# Altium schematic sheet P2.schdoc
size 297 x 209 mm; Symbol: Drawing-Symbol_A4; Company: 嘉立创EDA; Version: V1.0; Page Size: A4; @Project Name: 40Hz音箱; @Update Date: 2026-01-13; @Create Date: 2026-01-13; Device: Drawing-Symbol_A4; @Board Name: Board1; @Page Name: P2; @Create Time: 14:52:46; @Page Count: 1; @Page No: 0; @Schematic Name: Schematic1; @Update Time: 14:52:46; @Assembly Variant: Basic; Border: 1; Title Block Position: 3; Size: A4; Width: 1170; Height: 825; Region Start: 1; X Region Count: 6; Y Region Count: 4; Blade Width: 10
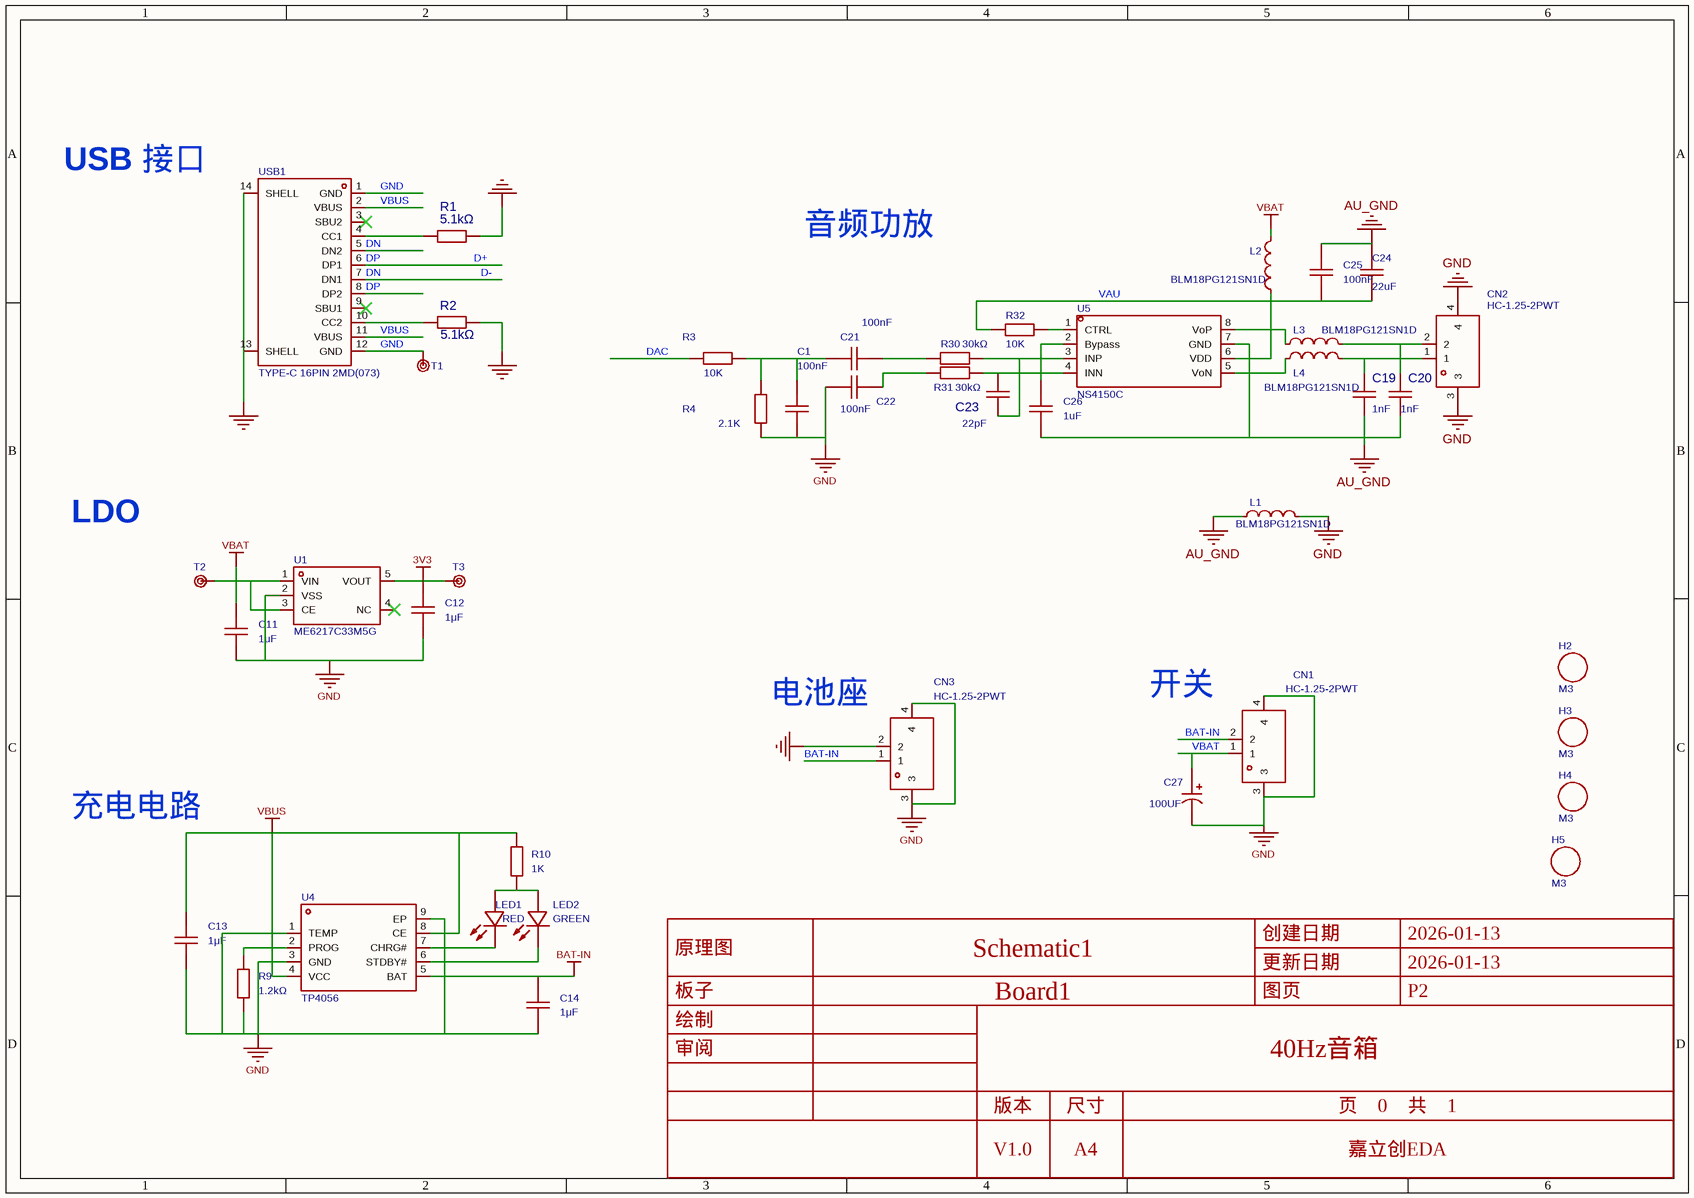
[diagram p0: P2.schdoc]

## Parts
C1  100nF  [C0603]
C11  1μF  [C0603]
C12  1μF  [C0603]
C13  1μF  [C0603]
C14  1μF  [C0603]
C19  1nF  [C0603]
C20  1nF  [C0603]
C21  100nF  [C0603]
C22  100nF  [C0603]
C23  22pF  [C0603]
C24  22uF  [C0603_1]
C25  100nF  [C0603]
C26  1uF  [C0603]
C27  100UF  [CAP-SMD_BD6.3-L6.6-W6.6-FD-1]
CN1  HC-1.25-2PWT  [CONN-SMD_2P-P1.25-HC-1.25-2PWT]
CN2  HC-1.25-2PWT  [CONN-SMD_2P-P1.25-HC-1.25-2PWT]
CN3  HC-1.25-2PWT  [CONN-SMD_2P-P1.25-HC-1.25-2PWT]
H2  M3  [M3 125X200(1)]
H3  M3  [M3 125X200(1)]
H4  M3  [M3 125X200(1)]
H5  M3  [M3 125X200(1)]
L1  BLM18PG121SN1D  [L0603]
L2  BLM18PG121SN1D  [L0603]
L3  BLM18PG121SN1D  [L0603]
L4  BLM18PG121SN1D  [L0603]
LED1  RED  [LED0805-R-RD]
LED2  GREEN  [LED0805-R-RD]
R1  5.1kΩ  [R0402]
R2  5.1kΩ  [R0402]
R3  10K  [R0603]
R4  2.1K  [R0603]
R9  1.2kΩ  [R0603]
R10  1K  [R0603]
R30  30kΩ  [R0603]
R31  30kΩ  [R0603]
R32  10K  [R0603]
T1  GND  [TP-TH-1.5mm]  (value not drawn)
T2  GND  [TP-TH-1.5mm]  (value not drawn)
T3  GND  [TP-TH-1.5mm]  (value not drawn)
U1  ME6217C33M5G  [SOT-23-5_L3.0-W1.7-P0.95-LS2.8-BR]
U4  TP4056  [ESOP-8_L4.9-W3.9-P1.27-LS6.0-BL-EP]
U5  NS4150C  [SOP-8_L4.9-W3.9-P1.27-LS6.0-BL]
USB1  TYPE-C 16PIN 2MD(073)  [USB-C-SMD_TYPE-C-6PIN-2MD-073_EX]

## Nets
3V3: C12.2 T3.1 U1.5(VOUT)
AU_GND: C19.1 C20.1 C24.1 C25.2 C26.1 L1.1 U5.7(GND)
BAT-IN: C14.2 CN1.2 CN3.1 U4.5(BAT)
GND: C1.1 C11.1 C12.1 C13.1 C14.1 C22.1 C27.2 CN1.3 CN1.4 CN2.3 CN2.4 CN3.2 CN3.3 CN3.4 L1.2 R1.1 R2.1 R4.1 R9.2 T1.1 U1.2(VSS) U4.1(TEMP) U4.3(GND) U4.9(EP) USB1.1(GND) USB1.12(GND) USB1.13(SHELL) USB1.14(SHELL)
VBAT: C11.2 C27.1 CN1.1 L2.2 T2.1 U1.1(VIN) U1.3(CE)
VBUS: C13.2 R10.1 U4.4(VCC) U4.8(CE) USB1.2(VBUS) USB1.11(VBUS)
D+: USB1.6(DP1) USB1.8(DP2)  [also labelled DP]
D-: USB1.5(DN2) USB1.7(DN1)  [also labelled DN]
DAC: R3.1
VAU: C24.2 C25.1 L2.1 R32.2 U5.6(VDD)
NetC1_2: C1.2 C21.1 R3.2 R4.2
NetC19_2: C19.2 CN2.1 L4.2
NetC20_2: C20.2 CN2.2 L3.2
NetC21_2: C21.2 R30.2
NetC22_2: C22.2 R31.2
NetC23_1: C23.1 R31.1 U5.4(INN)
NetC23_2: C23.2 R30.1 U5.3(INP)
NetC26_2: C26.2 U5.2(Bypass)
NetL3_1: L3.1 U5.8(VoP)
NetL4_1: L4.1 U5.5(VoN)
NetLED1_1: LED1.1(+) LED2.1(+) R10.2
NetLED1_2: LED1.2(-) U4.7(CHRG#)
NetLED2_2: LED2.2(-) U4.6(STDBY#)
NetR1_2: R1.2 USB1.4(CC1)
NetR2_2: R2.2 USB1.10(CC2)
NetR9_1: R9.1 U4.2(PROG)
NetR32_1: R32.1 U5.1(CTRL)

Not connected (* = marked no-connect by the designer): U1 4(NC)*; USB1 3(SBU2)* 9(SBU1)*

## Notes on the sheet
- USB 接口
- 音频功放
- LDO
- 电池座
- 开关
- 充电电路
- 创建日期
- 2026-01-13
- 原理图
- 板子
- Schematic1
- Board1
- 更新日期
- 图页
- P2
- 绘制
- 审阅
- 40Hz音箱
- 版本
- V1.0
- 尺寸
- A4
- 页    0    共    1
- 嘉立创EDA

## Library data of the parts
C1 C22 C26 = CAP_0603: Symbol: Capacitance; 3D Model: ac125912035d415993ca9572d50418b10819f05c4eef4c71ace90d822a990e87; 3D Model Transform: 62.992,31.496,0,0,0,0,0,0,0; ConvertToPcb: yes; ModelName: C0603_L1.6-W0.8-H0.8; Device: CAP_0603; Supplier Footprint: 0603; AddInBom: yes; FootprintName: C0603
  C1 C22: Value: 100nF
  C26: Value: 1uF
C11-C14 = CL10A105KB8NNNC: Manufacturer: SAMSUNG(三星); Add into BOM: yes; 3D Model: ac125912035d415993ca9572d50418b10819f05c4eef4c71ace90d822a990e87; 3D Model Transform: 62.992,31.496,0,0,0,0,0,0,0; ModelName: C0603_L1.6-W0.8-H0.8; Symbol: CL10A105KB8NNNC; Device: CL10A105KB8NNNC; Convert to PCB: yes; Manufacturer Part: CL10A105KB8NNNC; Supplier: LCSC; Supplier Part: CL10A105KB8NNNC.1; FootprintName: C0603
C19 C20 = 0402B102K500NT: 容值:1nF;精度:±10%;额定电压:50V;材质(温度系数):X7R;; Manufacturer: FH(风华); Symbol: 0402B102K500NT_1; Check: true; 3D Model: 36a51122f27c49738f86b3bfa98863e0; 3D Model Transform: 39.37,19.685,0,0,0,0,0,0,0; Tolerance: ±10%; Voltage Rated: 50V; Temperature Coefficient: X7R; AddInBom: yes; ModelName: C0402_L1.0-W0.5-H0.5; Device: 0402B102K500NT; LCSC Part Name: 1nF ±10% 50V; Supplier Footprint: 0402; Datasheet: https://atta.szlcsc.com/upload/public/pdf/source/20200305/C486355_26A10D38EF8C2A5C37091D0039909270.pdf; Value: 1nF; Supplier: LCSC; Manufacturer Part: 0402B102K500NT; Capacitance: 1nF; Supplier Part: C1523; ConvertToPcb: yes; FootprintName: C0603
C21 C25 = CGA0603X7R104K500JT: 容值:100nF;精度:±10%;额定电压:50V;温度系数:X7R;; Manufacturer: HRE(芯声); Add into BOM: yes; 3D Model: ac125912035d415993ca9572d50418b1; 3D Model Transform: 62.992,31.496,0,0,0,0,0,0,0; Tolerance: ±10%; Temperature Coefficient: X7R; Voltage Rating: 50V; ModelName: C0603_L1.6-W0.8-H0.8; Symbol: CGA0603X7R104K500JT; Device: CGA0603X7R104K500JT; Convert to PCB: yes; Supplier: LCSC; Manufacturer Part: CGA0603X7R104K500JT; Value: 100nF; Supplier Part: C6119867; JLCPCB Part Class: Extended Part; LCSC Part Name: 100nF ±10% 50V; Supplier Footprint: 0603; Datasheet: https://item.szlcsc.com/datasheet/CGA0603X7R104K500JT/7062573.html; FootprintName: C0603
C23 = 0402CG220J500NT: 容值:22pF;精度:±5%;额定电压:50V;材质(温度系数):C0G;; Manufacturer: FH(风华); Check: true; 3D Model: 36a51122f27c49738f86b3bfa98863e0; 3D Model Transform: 39.37,19.685,0,0,0,0,0,0,0; Tolerance: ±5%; Voltage Rated: 50V; Temperature Coefficient: C0G; AddInBom: yes; ModelName: C0402_L1.0-W0.5-H0.5; Symbol: 0402CG220J500NT; Device: 0402CG220J500NT; LCSC Part Name: 22pF ±5% 50V; Supplier Footprint: 0402; Datasheet: https://atta.szlcsc.com/upload/public/pdf/source/20200305/C486355_26A10D38EF8C2A5C37091D0039909270.pdf; Value: 22pF; Supplier: LCSC; Manufacturer Part: 0402CG220J500NT; Capacitance: 22pF; Supplier Part: C1555; ConvertToPcb: yes; FootprintName: C0603
C24 = CL10A226MO7JZNC: 容值:22uF;精度:±20%;额定电压:16V;材质(温度系数):X5R;; Manufacturer: SAMSUNG(三星); Check: true; 3D Model: ac125912035d415993ca9572d50418b1; 3D Model Transform: 62.992,31.496,0,0,0,0,0,0,0; Tolerance: ±20%; Voltage Rated: 16V; Temperature Coefficient: X5R; AddInBom: yes; ModelName: C0603_L1.6-W0.8-H0.8; Symbol: CL10A226MO7JZNC; Device: CL10A226MO7JZNC; LCSC Part Name: 22uF ±20% 16V; Supplier Part: C2762594; Manufacturer Part: CL10A226MO7JZNC; Supplier Footprint: 0603; Datasheet: https://atta.szlcsc.com/upload/public/pdf/source/20220811/0832C3B1C642040B023B7A6186895861.pdf; Supplier: LCSC; Value: 22uF; ConvertToPcb: yes; FootprintName: C0603_1
C27 = JVJ25V100M6x5: 容值:100uF;精度:±20%;额定电压:25V;纹波电流:72mA@120Hz;; Manufacturer: JIERR(捷而瑞); AddInBom: yes; ModelId: 041333f082e2432d92aae8a67d2335740819f05c4eef4c71ace90d822a990e87; ModelTransform: 299.212,259.842,0,0,0,0,0,0,0; Tolerance: ±20%; Voltage Rating: 25V; Lifetime: 2000hrs@105℃; Symbol: JVJ25V100M6X5; Device: JVJ25V100M6x5; LCSC Part Name: 100uF ±20% 25V; SupplierPart: C46550402; ManufacturerPart: JVJ25V100M6x5; Supplier Footprint: SMD,D6.3xL5.4mm; JLCPCB Part Class: Extended Part; Datasheet: https://item.szlcsc.com/datasheet/JVJ25V100M6x5/48680096.html; Supplier: LCSC; ConvertToPcb: yes; FootprintName: CAP-SMD_BD6.3-L6.6-W6.6-FD-1; ModelName: CAP-SMD_BD6.3-L6.6-W6.6-FD-1; Value: 100uF; Ripple Current: 72mA@120Hz; Diameter: 6.3mm; Height - Seated (Max): 5.4mm; Operating Temperature: -55℃~+105℃
CN1 = HC-1.25-2PWT: 插针结构:1x2P;间距:1.25mm;安装方式:卧贴;参考系列:PicoBlade(MX 1.25);总PIN数:2P;排数:1;每排PIN数:2;行距:-;额定电流:1A;触头材质:黄铜;触头镀层:锡;工作温度范围:-40℃~+105℃;; Manufacturer: HCTL(华灿天禄); Add into BOM: yes; Pitch: 1.25mm; Pins Structure: 1x2P; Number of PINs Per Row: 2; Current Rating (Max): 1A; 3D Model: ebb1673ebb69408eb1694436aeec70a1; 3D Model Transform: 295.275,206.693,0,0,0,0,0,-39.372,0; Rated Voltage (Max): 125V; Plastic Material: LCP; Flame Retardant Rating: UL94V-0; Supplementary Features: 辅助焊脚; Z-Height of the Board: 3.57mm; X-Length of Bottom Edge on Board (Spacing Line): 7.55mm; Y-Width of Bottom Edge on Board: 5.25mm; Symbol: HC-1.25-2PWT; Device: HC-1.25-2PWT; Convert to PCB: yes; LCSC Part Name: 1x2P 间距:1.25mm 卧贴 系列:PicoBlade(MX 1.25); Supplier Part: C2845379; Manufacturer Part: HC-1.25-2PWT; Supplier Footprint: SMD,P=1.25mm,卧贴; JLCPCB Part Class: Extended Part; Datasheet: https://atta.szlcsc.com/upload/public/pdf/source/20240930/9508A8292CCC87B0C29E3A028D56E30A.pdf; Supplier: LCSC; Reference Series: PicoBlade(MX 1.25); Number of Rows: 1; Row Spacing: -; Mounting Style: 卧贴; Contact Material: 黄铜; Contact Plating: 锡; Operating Temperature Range: -40℃~+105℃; Number of Pins: 2P; Colour: -; FootprintName: CONN-SMD_2P-P1.25-HC-1.25-2PWT; ModelName: CONN-SMD_2P-P1.25-HC-1.25-2PWT
CN2 CN3 = HC-1.25-2PWT: 插针结构:1x2P;间距:1.25mm;安装方式:卧贴;参考系列:PicoBlade(MX 1.25);总PIN数:2P;排数:1;每排PIN数:2;行距:-;额定电流:1A;触头材质:黄铜;触头镀层:锡;工作温度范围:-40℃~+105℃;; Manufacturer: HCTL(华灿天禄); 3D Model: ebb1673ebb69408eb1694436aeec70a10819f05c4eef4c71ace90d822a990e87; 3D Model Transform: 295.275,206.693,0,0,0,0,0,-39.372,0; Pins Structure: 1x2P; Pitch: 1.25mm; Number of PINs Per Row: 2; Current Rating (Max): 1A; Rated Voltage (Max): 125V; Plastic Material: LCP; Flame Retardant Rating: UL94V-0; Supplementary Features: 辅助焊脚; Z-Height of the Board: 3.57mm; X-Length of Bottom Edge on Board (Spacing Line): 7.55mm; Y-Width of Bottom Edge on Board: 5.25mm; AddInBom: yes; Symbol: HC-1.25-2PWT; Device: HC-1.25-2PWT; LCSC Part Name: 1x2P 间距:1.25mm 卧贴 系列:PicoBlade(MX 1.25); Supplier Part: C2845379; Manufacturer Part: HC-1.25-2PWT; Supplier Footprint: SMD,P=1.25mm,卧贴; JLCPCB Part Class: Extended Part; Datasheet: https://atta.szlcsc.com/upload/public/pdf/source/20240930/9508A8292CCC87B0C29E3A028D56E30A.pdf; Supplier: LCSC; Mounting Style: 卧贴; Reference Series: PicoBlade(MX 1.25); Number of Pins: 2P; Number of Rows: 1; Row Spacing: -; Contact Material: 黄铜; Contact Plating: 锡; Operating Temperature Range: -40℃~+105℃; Colour: -; ConvertToPcb: yes; FootprintName: CONN-SMD_2P-P1.25-HC-1.25-2PWT; ModelName: CONN-SMD_2P-P1.25-HC-1.25-2PWT
H2-H5 = M3: AddInBom: yes; Symbol: M3; Device: M3; ConvertToPcb: yes
L1-L4 = BLM18PG121SN1D: 阻抗@频率:120Ω@100MHz;误差:±25%;直流电阻(DCR):50mΩ;; Manufacturer: muRata(村田); Symbol: BLM18PG121SN1D_C14709; AddInBom: yes; ModelId: 2bc5ec593d464d6ba9807aec0b5673c20819f05c4eef4c71ace90d822a990e87; ModelName: L0603_L1.6-W0.8-H0.5_BEAD; ModelTransform: 62.992,31.496,0,180,0,0,0.094,0.629,0; Tolerance: ±25%; DC Resistance(DCR): 50mΩ; Current Rating: 2A; Number of Circuits: 1; Device: BLM18PG121SN1D; LCSC Part Name: 单路 0603磁珠 阻抗120Ω@100MHz; SupplierPart: C14709; ManufacturerPart: BLM18PG121SN1D; Supplier Footprint: 0603; JLCPCB Part Class: Basic Part; Datasheet: https://item.szlcsc.com/datasheet/BLM18PG121SN1D/15379.html; Supplier: LCSC; ConvertToPcb: yes; FootprintName: L0603; Impedance @ Frequency: 120Ω@100MHz; Operating Temperature: -55℃~+125℃
LED1 LED2 = NCD0805R1: Manufacturer: 国星光电; Symbol: FC-2012HRK-620D; Add into BOM: yes; 3D Model: 6ccd75a2b5134d6ab756ecf3c14a72900819f05c4eef4c71ace90d822a990e87; 3D Model Transform: 79.527,49.2125,0,0,0,0,0,0,0; ModelName: LED0805-RD; Device: NCD0805R1; Convert to PCB: yes; Manufacturer Part: NCD0805R1; Supplier: LCSC; Supplier Part: FC-2012HRK-620D.1; FootprintName: LED0805-R-RD
R1 R2 = 0402WGF5101TCE: 电阻类型:厚膜电阻;阻值:5.1kΩ;精度:±1%;功率:62.5mW;; Manufacturer: UNI-ROYAL(厚声); Symbol: 5k1; Add into BOM: yes; Origin Footprint: R0603; Tolerance: ±1%; Power(Watts): 62.5mW; Temperature Coefficient: ±100ppm/℃; Overload Voltage (Max): 50V; Check: false; 3D Model: 671aefced39d4c318694bba8bd8efd39; 3D Model Transform: 39.37,19.685,0,0,0,0,0,0.0005,0; ModelName: R0402_L1.0-W0.5-H0.5; Device: 0402WGF5101TCE; Convert to PCB: yes; Supplier Part: C25905; LCSC Part Name: 5.1kΩ±1%62.5mW; Supplier Footprint: 0402; JLCPCB Part Class: BasicPart; Datasheet: https://atta.szlcsc.com/upload/public/pdf/source/20200306/C422600_1E6D84923E4A46A82E41ADD87F860B5C.pdf; Type: 厚膜电阻; Value: 5.1kΩ; Operating Temperature Range: -55℃~+155℃; Manufacturer Part: 0402WGF5101TCE; Supplier: LCSC; FootprintName: R0402
R3 = Res_0603: Symbol: 电阻; 3D Model: fc143cca1e79419f9cd78b61e9279f080819f05c4eef4c71ace90d822a990e87; 3D Model Transform: 31.8897,63.7794,0,90,0,0,0,0,0; ConvertToPcb: yes; Device: Res_0603; Supplier Footprint: 0603; Value: 10K; AddInBom: yes; FootprintName: R0603; ModelName: R0603
R4 = Res_0603: Symbol: 电阻; 3D Model: fc143cca1e79419f9cd78b61e9279f080819f05c4eef4c71ace90d822a990e87; 3D Model Transform: 31.8897,63.7794,0,90,0,0,0,0,0; Value: 10K; ConvertToPcb: yes; Device: Res_0603; Supplier Footprint: 0603; AddInBom: yes; FootprintName: R0603; ModelName: R0603
R9 R10 = 0603WAF1002T5E: Manufacturer: UNI-ROYAL(厚声); Add into BOM: yes; 3D Model: fc143cca1e79419f9cd78b61e9279f080819f05c4eef4c71ace90d822a990e87; 3D Model Transform: 31.8897,63.7794,0,90,0,0,0,0,0; Symbol: 0603WAF1002T5E; Device: 0603WAF1002T5E; Convert to PCB: yes; Manufacturer Part: 0603WAF1002T5E; Supplier: LCSC; Supplier Part: 0603WAF1002T5E.1; FootprintName: R0603; ModelName: R0603
R30 R31 = 0603WAF3002T5E: 电阻类型:厚膜电阻;阻值:30kΩ;精度:±1%;功率:100mW;工作电压:75V;温度系数:±100ppm/℃;; Manufacturer: UNI-ROYAL(厚声); Add into BOM: yes; 3D Model: fc143cca1e79419f9cd78b61e9279f08; 3D Model Transform: 31.8897,63.7794,0,90,0,0,0,0,0; Tolerance: ±1%; Power(Watts): 100mW; Voltage-Supply(Max): 75V; Symbol: 0603WAF3002T5E; Device: 0603WAF3002T5E; Convert to PCB: yes; LCSC Part Name: 30kΩ ±1% 100mW 厚膜电阻; Supplier Part: C22984; Manufacturer Part: 0603WAF3002T5E; Supplier Footprint: 0603; JLCPCB Part Class: Basic Part; Datasheet: https://item.szlcsc.com/datasheet/0603WAF3002T5E/23711.html; Supplier: LCSC; Type: 厚膜电阻; Value: 30kΩ; Temperature Coefficient: ±100ppm/℃; Operating Temperature: -55℃~+155℃; FootprintName: R0603; ModelName: R0603
R32 = Res_0603: Symbol: 电阻; ConvertToPcb: yes; ModelId: fc143cca1e79419f9cd78b61e9279f080819f05c4eef4c71ace90d822a990e87; ModelTransform: 31.8897,63.7794,0,90,0,0,0,0,0; Device: Res_0603; AddInBom: yes; Supplier Footprint: 0603; FootprintName: R0603; ModelName: R0603; Value: 10K
T1-T3 = 测试孔: AddInBom: yes; Symbol: 测试孔; Device: 测试孔; ConvertToPcb: yes; FootprintName: TP-TH-1.5mm
U1 = ME6217C33M5G: 输出类型:固定;工作电压:6.5V;输出电压:3.3V;输出电流:800mA;电源纹波抑制比(PSRR):65dB@(1kHz);输出极性:正极;; Manufacturer: MICRONE(南京微盟); 3D Model: 0a2a1b8f50944f73965918ad6e5fe1670819f05c4eef4c71ace90d822a990e87; 3D Model Transform: 114.173,109.636,0,180,0,0,0,0,0; Output Type: 固定; Voltage - Supply: 6.5V; Output Voltage: 3.3V; Output Current: 800mA; Voltage Dropout: 180mV@(300mA); standby current: 100uA; Output Configuration: 正极; Number of Outputs: 1; AddInBom: yes; ModelName: SOT-23-5_L2.9-W1.6-H1.1-LS2.8-P0.95; Symbol: ME6217C33M5G; Device: ME6217C33M5G; LCSC Part Name: 输入7V 输出3.3V 800mA; Supplier Part: C427602; Manufacturer Part: ME6217C33M5G; Supplier Footprint: SOT-23-5; JLCPCB Part Class: Extended Part; Datasheet: https://item.szlcsc.com/datasheet/ME6217C33M5G/421842.html; Supplier: LCSC; Power Supply Rejection Ratio (PSRR): 65dB@(1kHz); Features: 过热保护；带使能; Operating Temperature: -40℃~+85℃; ConvertToPcb: yes; FootprintName: SOT-23-5_L3.0-W1.7-P0.95-LS2.8-BR
U4 = TP4056_C725790: 工作电压:3.7V~6.5V;最大充电电流:1A;电池类型:锂离子;电池节数:1;; Manufacturer: UMW(友台半导体); AddInBom: yes; ModelId: d3e00daa36c445139c055a3b9efb85d20819f05c4eef4c71ace90d822a990e87; ModelName: ESOP-8_L4.9-W3.9-H1.6-LS6.0-P1.27; ModelTransform: 240.157,192.913,0,90,0,0,0,0,0; The Chip Type: 线性充电芯片; Charge Current - Max: 1A; Charging Saturation Voltage: 4.2V; Type of Battery: 锂离子; Number of Cells: 1; Battery Temperature Detection: 支持; Supply Current (Iq): 35uA; Symbol: TP4056_C725790; Device: TP4056_C725790; LCSC Part Name: 1A独立式线性锂离子电池充电器; SupplierPart: C725790; ManufacturerPart: TP4056; Supplier Footprint: ESOP-8; JLCPCB Part Class: Extended Part; Datasheet: https://item.szlcsc.com/datasheet/TP4056/772193.html; Supplier: LCSC; ConvertToPcb: yes; FootprintName: ESOP-8_L4.9-W3.9-P1.27-LS6.0-BL-EP; Voltage - Supply: 3.7V~6.5V; Operating Temperature: -40℃~+85℃; 0V Battery Charge: 支持
U5 = NS4150C: 功放类型:D类功放;扬声器通道数:单声道;输出功率:2.8Wx1@4Ω;静态电流(Iq):4mA;; Manufacturer: Nsiway(纳芯威); AddInBom: yes; ModelId: 75c24a7891ee4dd6bdac16a7163ff87e0819f05c4eef4c71ace90d822a990e87; ModelName: SOP-8_L4.9-W3.9-P1.27-LS6.0-BL-1; ModelTransform: 192.913,236.22,0,0,0,0,0,0,0; Class: D类功放; Speaker Channels: 单声道; Voltage - Supply: 3V~5V; Total Harmonic Distortion + Noise (THD+N): 0.1%; Quiescent Current: 4mA; Input Type: 差分; Power Supply Rejection Ratio (PSRR): 80dB; Efficiency: 88%；90%; Number of Inputs: 1对差分输入; Symbol: NS4150C; Device: NS4150C; LCSC Part Name: 3.0W单声道D类音频功率放大器; SupplierPart: C2875838; ManufacturerPart: NS4150C; Supplier Footprint: SOP-8; JLCPCB Part Class: Extended Part; Datasheet: https://item.szlcsc.com/datasheet/NS4150C/3083619.html; Supplier: LCSC; ConvertToPcb: yes; FootprintName: SOP-8_L4.9-W3.9-P1.27-LS6.0-BL; Output Power: 2.8Wx1@4Ω; Operating Temperature: -40℃~+85℃
USB1 = TYPE-C 16PIN 2MD(073): 连接器类型:Type-C;标准:-;公母:母;端口数量:1;触点数量:16P;安装方式:卧贴;额定电流 - 电源:5A;工作温度范围:-25℃~+85℃;; Manufacturer: SHOU HAN(首韩); Gender: 母; Number of Ports: 1; Number of Contacts: 16P; Current Rating - Power (Max): 5A; 3D Model: 3a41b9ec9b654a0fad4d118405ec6290; 3D Model Transform: 351.9678,298.4246,0,0,0,0,0,-47.244,-35.433; AddInBom: yes; ModelName: USB-C-SMD_TYPE-C-6PIN-2MD-073; Symbol: TYPE-C 16PIN 2MD(073); Device: TYPE-C 16PIN 2MD(073); Supplier: LCSC; Supplier Part: C2765186; Manufacturer Part: TYPE-C 16PIN 2MD(073); JLCPCB Part Class: 扩展库; LCSC Part Name: Type-C 母 卧贴; Supplier Footprint: SMD; Datasheet: https://atta.szlcsc.com/upload/public/pdf/source/20211123/39B17C16241EAC15C5E277BDA434118E.pdf; Connector Type: Type-C; Standard: -; Mounting Style: 卧贴; Operating Temperature Range: -25℃~+85℃; ConvertToPcb: yes; FootprintName: USB-C-SMD_TYPE-C-6PIN-2MD-073_EX